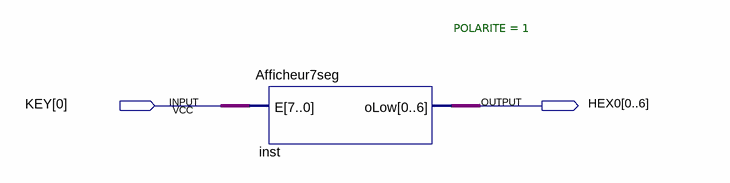
[diagram p0: schematic sheet]
// Quartus schematic Afficheur7seg.bdf as structural Verilog: 1 symbols, 2 pins
module Afficheur7seg (
  input  [0:0] KEY,
  output [0:6] HEX0
);

  wire [7:0] undriven;

  Afficheur7seg #(.POLARITE(1)) inst (.E(undriven), .oLow(HEX0));
endmodule
